# Altium schematic sheet Main.SchDoc: =ProjectName
size 558 x 431 mm; ApprovedBy: Ali Ebrahimian; CheckedBy: Ali Ebrahimian; Author: Ali Ebrahimian; Engineer: Ali Ebrahimian; Organization: Free; Revision: 1.0; SheetNumber: 1; SheetTotal: 4
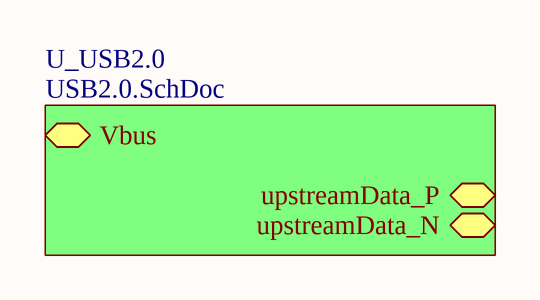
[diagram p0: Main.SchDoc]

## Sub-sheets
U_USB2.0 = USB2.0.SchDoc: Vbus (bidir), upstreamData_N (bidir), upstreamData_P (bidir)

## Notes on the sheet
- DWG. NO.
- REV.
- SHT.
- REVISION
- DESCRIPTION
- DATE
- APPROVED
- THIS DOCUMENT AND THE DATA DISCLOSED HEREIN OR HEREWITH IS THE PROPERTY OF ALTIUM LIMITED AND MAY BE FREELY DISTRIBUTED IN WHOLE. NO RIGHTS ARE RESERVED OR EXPRESS OR IMPLIED WARANTEE GIVEN.
- ENG:
- DSN:
- APPROVALS
- PROJECT
- DOCUMENT REVISION:
- DESIGN ITEM:
- CHK:
- BOM:
- REFERENCE DOCUMENTS
- PROJECT REVISION:
- TITLE
- FAB DWG:
- PCB DWG:
- ASSY DWG:
- SCALE:
- SIZE
- C
- CAGE CODE
- FILE NAME
- DWG NO.
- SHEET
- OF
- REV